# Altium schematic sheet QRE1113-1.SchDoc
size A
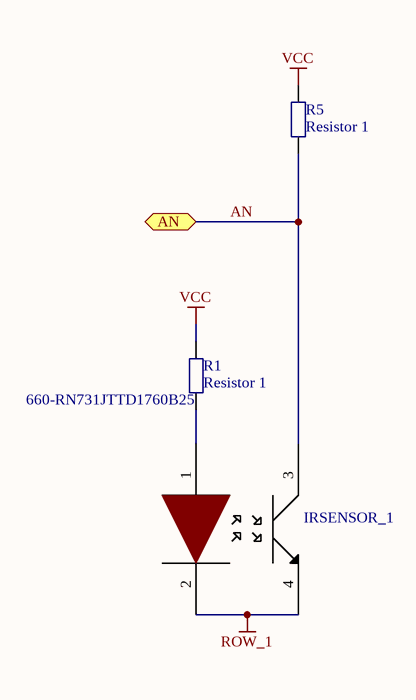
[diagram p0: QRE1113-1.SchDoc]

## Parts
IRSENSOR_1  QRE1113GR  [QRE1113GR]  (value not drawn)
R1  Resistor 1  Supplier Part Number 2: 660-RN731JTTD1760B25  [R-0603]
R5  Resistor 1  [R-0603]

## Ports
AN

## Nets
ROW_1: IRSENSOR_1.2 IRSENSOR_1.4
VCC: R1.1 R5.1
AN: IRSENSOR_1.3 R5.2 ; port AN
NetIRSENSOR_1_1: IRSENSOR_1.1 R1.2

## Library data of the parts
R1 R5 = Resistor 1: Resistor; Value: 1K
  R1: Supplier 1: Arrow; Supplier 2: Mouser
  R5: Supplier 1: Newark; Supplier Part Number 1: 68Y8139